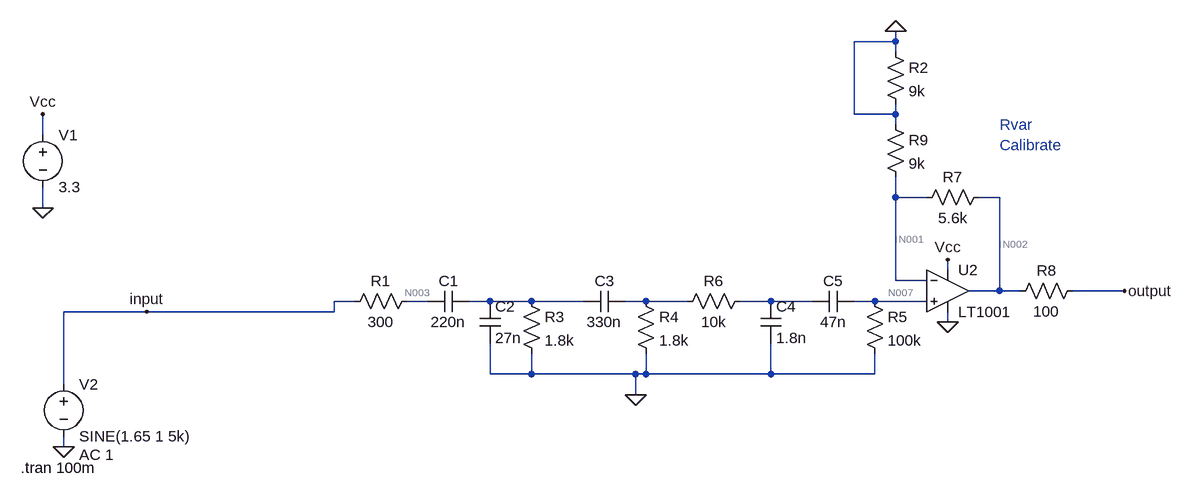
[diagram p0: schematic a weighting filter.asc]
a weighting filter.asc, the LTspice schematic file:
Version 4
SHEET 1 1176 680
WIRE 720 -288 720 -304
WIRE 720 -288 656 -288
WIRE 720 -272 720 -288
WIRE 656 -176 656 -288
WIRE 720 -176 720 -192
WIRE 720 -176 656 -176
WIRE 720 -160 720 -176
WIRE -592 -144 -592 -176
WIRE 720 -48 720 -80
WIRE 768 -48 720 -48
WIRE 880 -48 848 -48
WIRE -592 -32 -592 -64
WIRE 800 64 800 48
WIRE 720 80 720 -48
WIRE 768 80 720 80
WIRE 880 96 880 -48
WIRE 880 96 832 96
WIRE 912 96 880 96
WIRE 1072 96 992 96
WIRE -112 112 -144 112
WIRE 0 112 -32 112
WIRE 96 112 64 112
WIRE 160 112 96 112
WIRE 240 112 160 112
WIRE 336 112 304 112
WIRE 400 112 336 112
WIRE 528 112 480 112
WIRE 592 112 528 112
WIRE 688 112 656 112
WIRE 768 112 688 112
WIRE -432 128 -560 128
WIRE -144 128 -144 112
WIRE -144 128 -432 128
WIRE 800 144 800 128
WIRE 96 224 96 176
WIRE 160 224 160 192
WIRE 160 224 96 224
WIRE 320 224 160 224
WIRE 336 224 336 192
WIRE 336 224 320 224
WIRE 528 224 528 176
WIRE 528 224 336 224
WIRE 688 224 688 192
WIRE 688 224 528 224
WIRE -560 240 -560 128
WIRE 320 256 320 224
WIRE -560 336 -560 320
FLAG -592 -32 0
FLAG -592 -176 Vcc
FLAG -560 336 0
FLAG 800 144 0
FLAG 800 48 Vcc
FLAG 320 256 0
FLAG 1072 96 output
FLAG -432 128 input
FLAG 720 -304 0
SYMBOL voltage -592 -160 R0
WINDOW 123 0 0 Left 2
WINDOW 39 0 0 Left 2
SYMATTR InstName V1
SYMATTR Value 3.3
SYMBOL res -16 96 R90
WINDOW 0 0 56 VBottom 2
WINDOW 3 32 56 VTop 2
SYMATTR InstName R1
SYMATTR Value 300
SYMBOL cap 64 96 R90
WINDOW 0 0 32 VBottom 2
WINDOW 3 32 32 VTop 2
SYMATTR InstName C1
SYMATTR Value 220n
SYMBOL voltage -560 224 R0
WINDOW 123 24 124 Left 2
WINDOW 39 0 0 Left 2
SYMATTR InstName V2
SYMATTR Value SINE(1.65 1 5k)
SYMATTR Value2 AC 1
SYMBOL cap 80 112 R0
SYMATTR InstName C2
SYMATTR Value 27n
SYMBOL res 144 96 R0
SYMATTR InstName R3
SYMATTR Value 1.8k
SYMBOL cap 304 96 R90
WINDOW 0 0 32 VBottom 2
WINDOW 3 32 32 VTop 2
SYMATTR InstName C3
SYMATTR Value 330n
SYMBOL res 320 96 R0
SYMATTR InstName R4
SYMATTR Value 1.8k
SYMBOL cap 512 112 R0
SYMATTR InstName C4
SYMATTR Value 1.8n
SYMBOL cap 656 96 R90
WINDOW 0 0 32 VBottom 2
WINDOW 3 32 32 VTop 2
SYMATTR InstName C5
SYMATTR Value 47n
SYMBOL res 672 96 R0
SYMATTR InstName R5
SYMATTR Value 100k
SYMBOL Opamps\\LT1001 800 32 R0
SYMATTR InstName U2
SYMBOL res 496 96 R90
WINDOW 0 0 56 VBottom 2
WINDOW 3 32 56 VTop 2
SYMATTR InstName R6
SYMATTR Value 10k
SYMBOL res 864 -64 R90
WINDOW 0 0 56 VBottom 2
WINDOW 3 32 56 VTop 2
SYMATTR InstName R7
SYMATTR Value 5.6k
SYMBOL res 1008 80 R90
WINDOW 0 0 56 VBottom 2
WINDOW 3 32 56 VTop 2
SYMATTR InstName R8
SYMATTR Value 100
SYMBOL res 704 -176 R0
SYMATTR InstName R9
SYMATTR Value 9k
SYMBOL res 704 -288 R0
SYMATTR InstName R2
SYMATTR Value 9k
TEXT -626 368 Left 2 !.tran 100m
TEXT 880 -160 Left 2 ;Rvar\nCalibrate

The netlist it stands for:
* a weighting filter.asc
V1 Vcc 0 3.3
R1 N003 input 300
C1 N004 N003 220n
V2 input 0 SINE(1.65 1 5k) AC 1
C2 N004 0 27n
R3 N004 0 1.8k
C3 N005 N004 330n
R4 N005 0 1.8k
C4 N006 0 1.8n
C5 N007 N006 47n
R5 N007 0 100k
XU2 N007 N001 Vcc 0 N002 LT1001  ; pins In+ In- V+ V- OUT
R6 N006 N005 10k
R7 N002 N001 5.6k
R8 output N002 100
R9 0 N001 9k
R2 0 0 9k
.tran 100m
* Rvar
* Calibrate
.lib LTC.lib
.backanno
.end

* Results of the author's LTspice run, read from the files saved beside the schematic
* Operating Point, zero values left out:
*   V(vcc) = 3.3 V
*   V(n003) = 1.65 V
*   V(input) = 1.65 V
*   V(n007) = 772.7 µV
*   V(n001) = 572.9 mV
*   V(n002) = 929.4 mV
*   V(output) = 929.4 mV
*   I(R9) = -63.65 µA
*   I(R7) = 63.66 µA
*   I(R5) = 7.727 nA
*   I(V1) = -2.284 mA
*   Ix(u2:1) = -7.727 nA
*   Ix(u2:2) = 7.722 nA
*   Ix(u2:3) = 2.284 mA
*   Ix(u2:4) = -2.216 mA
*   Ix(u2:5) = -63.66 µA